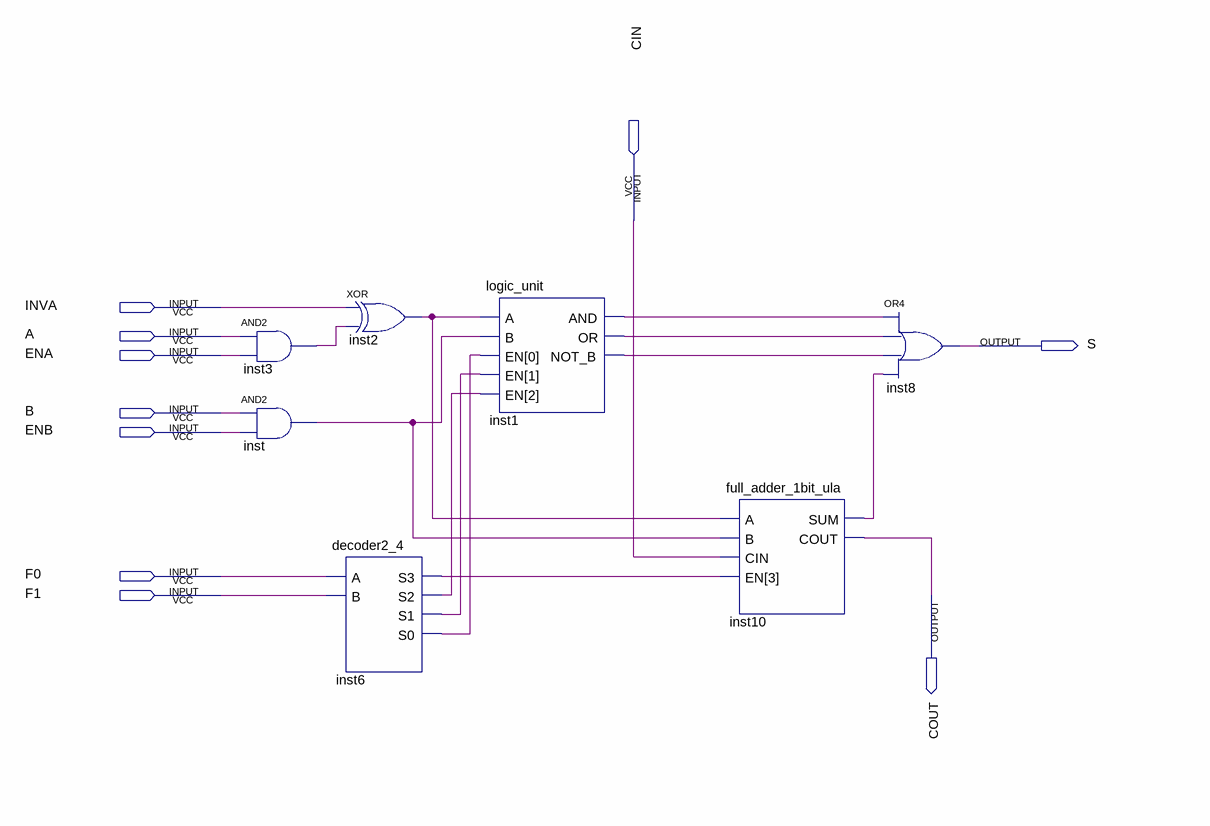
[diagram p0: schematic sheet]
// Quartus schematic ula_1bit.bdf as structural Verilog: 7 symbols, 10 pins
module ula_1bit (
  input  CIN,
  input  INVA,
  input  A,
  input  ENA,
  input  B,
  input  ENB,
  input  F0,
  input  F1,
  output S,
  output COUT
);

  wire inst1_and, inst1_not_b, inst1_or, inst2_out, inst3_out, inst6_s0, inst6_s1, inst6_s2, inst6_s3,
       inst10_sum, inst_out;

  and inst3 (inst3_out, A, ENA);
  and inst (inst_out, B, ENB);
  xor inst2 (inst2_out, INVA, inst3_out);
  decoder2_4 inst6 (.A(F0), .B(F1), .S3(inst6_s3), .S2(inst6_s2), .S1(inst6_s1), .S0(inst6_s0));
  logic_unit inst1 (
    .A(inst2_out), .B(inst_out), .EN({inst6_s2, inst6_s1, inst6_s0}), .AND(inst1_and), .OR(inst1_or),
    .NOT_B(inst1_not_b));
  full_adder_1bit_ula inst10 (.A(inst2_out), .B(inst_out), .CIN(CIN), .EN(inst6_s3), .SUM(inst10_sum), .COUT(COUT));
  or inst8 (S, inst1_and, inst1_or, inst1_not_b, inst10_sum);
endmodule
